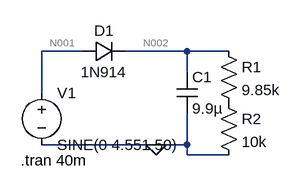
[diagram p0: schematic Draft1.asc]
Draft1.asc, the LTspice schematic file:
Version 4
SHEET 1 880 680
WIRE 192 80 128 80
WIRE 352 80 256 80
WIRE 416 80 352 80
WIRE 352 112 352 80
WIRE 128 144 128 80
WIRE 304 224 128 224
WIRE 352 224 352 176
WIRE 352 224 304 224
WIRE 352 240 352 224
WIRE 416 240 352 240
FLAG 304 224 0
SYMBOL voltage 128 128 R0
WINDOW 123 0 0 Left 2
WINDOW 39 0 0 Left 2
SYMATTR InstName V1
SYMATTR Value SINE(0 4.551 50)
SYMBOL diode 192 96 R270
WINDOW 0 32 32 VTop 2
WINDOW 3 0 32 VBottom 2
SYMATTR InstName D1
SYMATTR Value 1N914
SYMBOL cap 336 112 R0
SYMATTR InstName C1
SYMATTR Value 9.9µ
SYMBOL res 400 64 R0
SYMATTR InstName R1
SYMATTR Value 9.85k
SYMBOL res 400 144 R0
SYMATTR InstName R2
SYMATTR Value 10k
TEXT 96 248 Left 2 !.tran 40m

The netlist it stands for:
* Draft1.asc
V1 N001 0 SINE(0 4.551 50)
D1 N001 N002 1N914
C1 N002 0 9.9µ
R1 N002 P001 9.85k
R2 P001 0 10k
.model D D
.lib standard.dio
.tran 40m
.backanno
.end

* Results of the author's LTspice run, read from the files saved beside the schematic
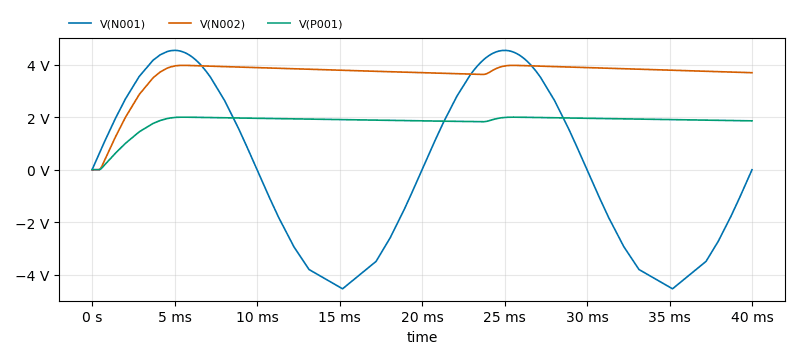
[diagram p1: Transient Analysis of Draft1.asc, plotted from the saved traces]
* Transient Analysis, 1 run:
*   V(N001): min -4.539 V, max 4.551 V, average 29.7 mV, rms 3.188 V, last 0 V
*   V(N002): min 0 V, max 3.979 V, average 3.625 V, rms 3.696 V, last 3.699 V
*   V(P001): min 0 V, max 2.004 V, average 1.826 V, rms 1.862 V, last 1.864 V